# Altium schematic sheet [01] - BLOCK DIAGRAM.SchDoc: Desk Digital Clock
size A4; DrawnBy: Ramil Teregulov; Address1: https://github.com/teregulov; Address2: https://github.com/teregulov/Desk-Digital-Clock; DocumentNumber: DDC-1; Revision: 1R0; SheetNumber: 1; SheetTotal: 7
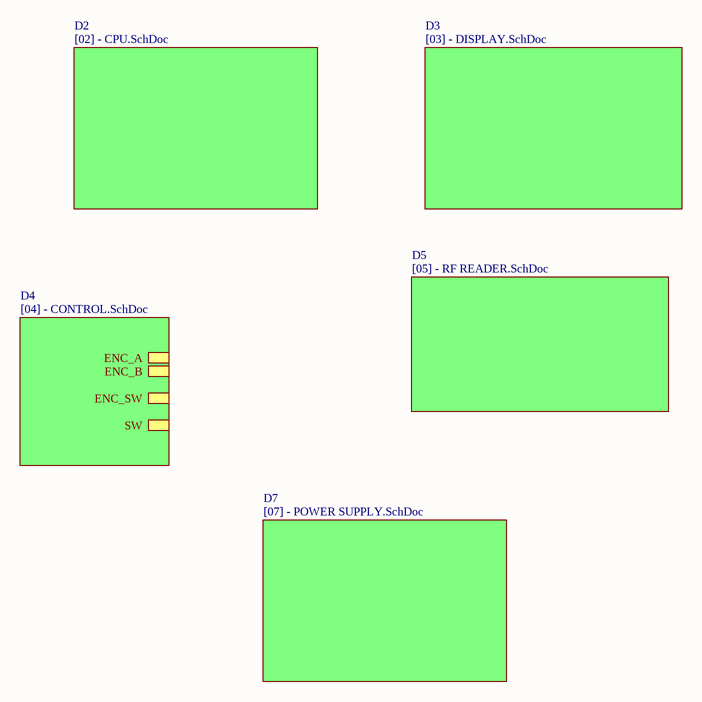
[diagram p0: [01] - BLOCK DIAGRAM.SchDoc]

## Sub-sheets
D2 = [02] - CPU.SchDoc: no entries
D3 = [03] - DISPLAY.SchDoc: no entries
D4 = [04] - CONTROL.SchDoc: ENC_A, ENC_B, ENC_SW, SW
D5 = [05] - RF READER.SchDoc: no entries
D7 = [07] - POWER SUPPLY.SchDoc: no entries

## Notes on the sheet
- Title:
- Size:
- Date:
- A4
- Number:
- Time:
- Revision:
- Sheet
- of
- File: